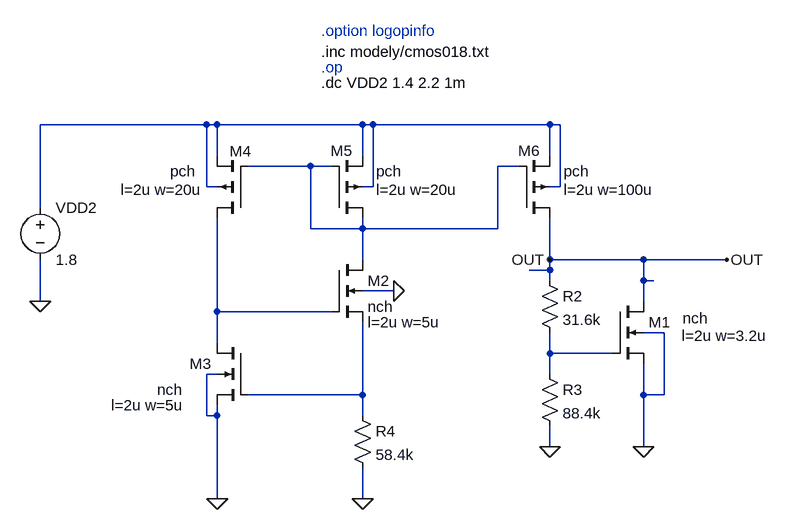
[diagram p0: schematic UREF-lepci.asc]
UREF-lepci.asc, the LTspice schematic file:
Version 4
SHEET 1 880 680
WIRE -496 -256 -752 -256
WIRE -480 -256 -496 -256
WIRE -256 -256 -480 -256
WIRE -240 -256 -256 -256
WIRE 32 -256 -240 -256
WIRE 48 -256 32 -256
WIRE -480 -208 -480 -256
WIRE -256 -208 -256 -256
WIRE 32 -208 32 -256
WIRE -336 -192 -432 -192
WIRE -304 -192 -336 -192
WIRE -16 -192 -48 -192
WIRE -496 -160 -496 -256
WIRE -480 -160 -496 -160
WIRE -240 -160 -240 -256
WIRE -240 -160 -256 -160
WIRE 48 -160 48 -256
WIRE 48 -160 32 -160
WIRE -752 -128 -752 -256
WIRE -336 -96 -336 -192
WIRE -256 -96 -256 -112
WIRE -256 -96 -336 -96
WIRE -48 -96 -48 -192
WIRE -48 -96 -256 -96
WIRE -256 -48 -256 -96
WIRE 32 -48 32 -112
WIRE 176 -48 32 -48
WIRE 304 -48 176 -48
WIRE 32 -32 32 -48
WIRE 32 -32 0 -32
WIRE 32 -16 32 -32
WIRE 176 -16 176 -48
WIRE 192 -16 176 -16
WIRE -208 0 -256 0
WIRE -752 16 -752 -48
WIRE 176 16 176 -16
WIRE -480 32 -480 -112
WIRE -304 32 -480 32
WIRE 208 64 176 64
WIRE -480 80 -480 32
WIRE 32 96 32 64
WIRE 128 96 32 96
WIRE -480 128 -496 128
WIRE 32 128 32 96
WIRE -256 160 -256 48
WIRE -256 160 -432 160
WIRE 176 160 176 112
WIRE 208 160 208 64
WIRE 208 160 176 160
WIRE -496 192 -496 128
WIRE -480 192 -480 176
WIRE -480 192 -496 192
WIRE -256 192 -256 160
WIRE 32 240 32 208
WIRE 176 240 176 160
WIRE -480 320 -480 192
WIRE -256 320 -256 272
FLAG 176 240 0
FLAG 32 240 0
FLAG 304 -48 OUT
FLAG -752 16 0
FLAG -256 320 0
FLAG -480 320 0
FLAG -208 0 0
FLAG 32 -48 OUT
DATAFLAG 208 -48 "round($*100)/100"
DATAFLAG 0 -32 "round(I(R2)*10e6)/10e6"
DATAFLAG 192 -16 "round(Id(M1)*10e6)/10e6"
DATAFLAG 80 96 "round($*100)/100"
DATAFLAG -368 -192 "round($*1e4)/1e4"
DATAFLAG -384 32 "round($*1e4)/1e4"
DATAFLAG -320 160 "round($*1e4)/1e4"
DATAFLAG -496 -256 "round(Is(M2)*10e6)/10e6"
DATAFLAG -272 -256 "round(Is(M4)*10e6)/10e6"
DATAFLAG 32 -256 "round(Is(M6)*10e6)/10e6"
SYMBOL nmos4 128 16 R0
WINDOW 123 107 53 Left 2
WINDOW 3 108 26 Left 2
SYMATTR Value2 l=2u w=3.2u
SYMATTR Value nch
SYMATTR InstName M1
SYMBOL res 16 -32 R0
SYMATTR InstName R2
SYMATTR Value 31.6k
SYMBOL res 16 112 R0
SYMATTR InstName R3
SYMATTR Value 88.4k
SYMBOL nmos4 -304 -48 R0
WINDOW 123 56 96 Left 2
SYMATTR Value2 l=2u w=5u
SYMATTR InstName M2
SYMATTR Value nch
SYMBOL voltage -752 -144 R0
SYMATTR InstName VDD2
SYMATTR Value 1.8
SYMBOL nmos4 -432 80 M0
WINDOW 123 99 96 Left 2
WINDOW 3 101 72 Left 2
SYMATTR Value2 l=2u w=5u
SYMATTR Value nch
SYMATTR InstName M3
SYMBOL res -272 176 R0
SYMATTR InstName R4
SYMATTR Value 58.4k
SYMBOL pmos4 -432 -112 R180
WINDOW 0 -5 103 Left 2
WINDOW 3 81 72 Left 2
WINDOW 123 71 44 Left 2
SYMATTR InstName M4
SYMATTR Value pch
SYMATTR Value2 l=2u w=20u
SYMBOL pmos4 -304 -112 M180
WINDOW 0 -1 104 Left 2
WINDOW 3 69 72 Left 2
WINDOW 123 69 44 Left 2
SYMATTR InstName M5
SYMATTR Value pch
SYMATTR Value2 l=2u w=20u
SYMBOL pmos4 -16 -112 M180
WINDOW 0 -1 104 Left 2
WINDOW 3 69 72 Left 2
WINDOW 123 69 44 Left 2
SYMATTR InstName M6
SYMATTR Value pch
SYMATTR Value2 l=2u w=100u
TEXT -320 -368 Left 2 !.inc modely/cmos018.txt
TEXT -320 -344 Left 2 ;.op
TEXT -320 -400 Left 2 ;.option logopinfo
TEXT -320 -320 Left 2 !.dc VDD2 1.4 2.2 1m

The netlist it stands for:
* UREF-lepci.asc
M1 OUT N004 0 0 nch l=2u w=3.2u
R2 OUT N004 31.6k
R3 N004 0 88.4k
M2 N002 N003 N005 0 nch l=2u w=5u
VDD2 N001 0 1.8
M3 N003 N005 0 0 nch l=2u w=5u
R4 N005 0 58.4k
M4 N003 N002 N001 N001 pch l=2u w=20u
M5 N002 N002 N001 N001 pch l=2u w=20u
M6 OUT N002 N001 N001 pch l=2u w=100u
.model NMOS NMOS
.model PMOS PMOS
.lib standard.mos
.inc modely/cmos018.txt
* .op
* .option logopinfo
.dc VDD2 1.4 2.2 1m
.backanno
.end